# EAGLE design breakout (EAGLE 9.4.2)
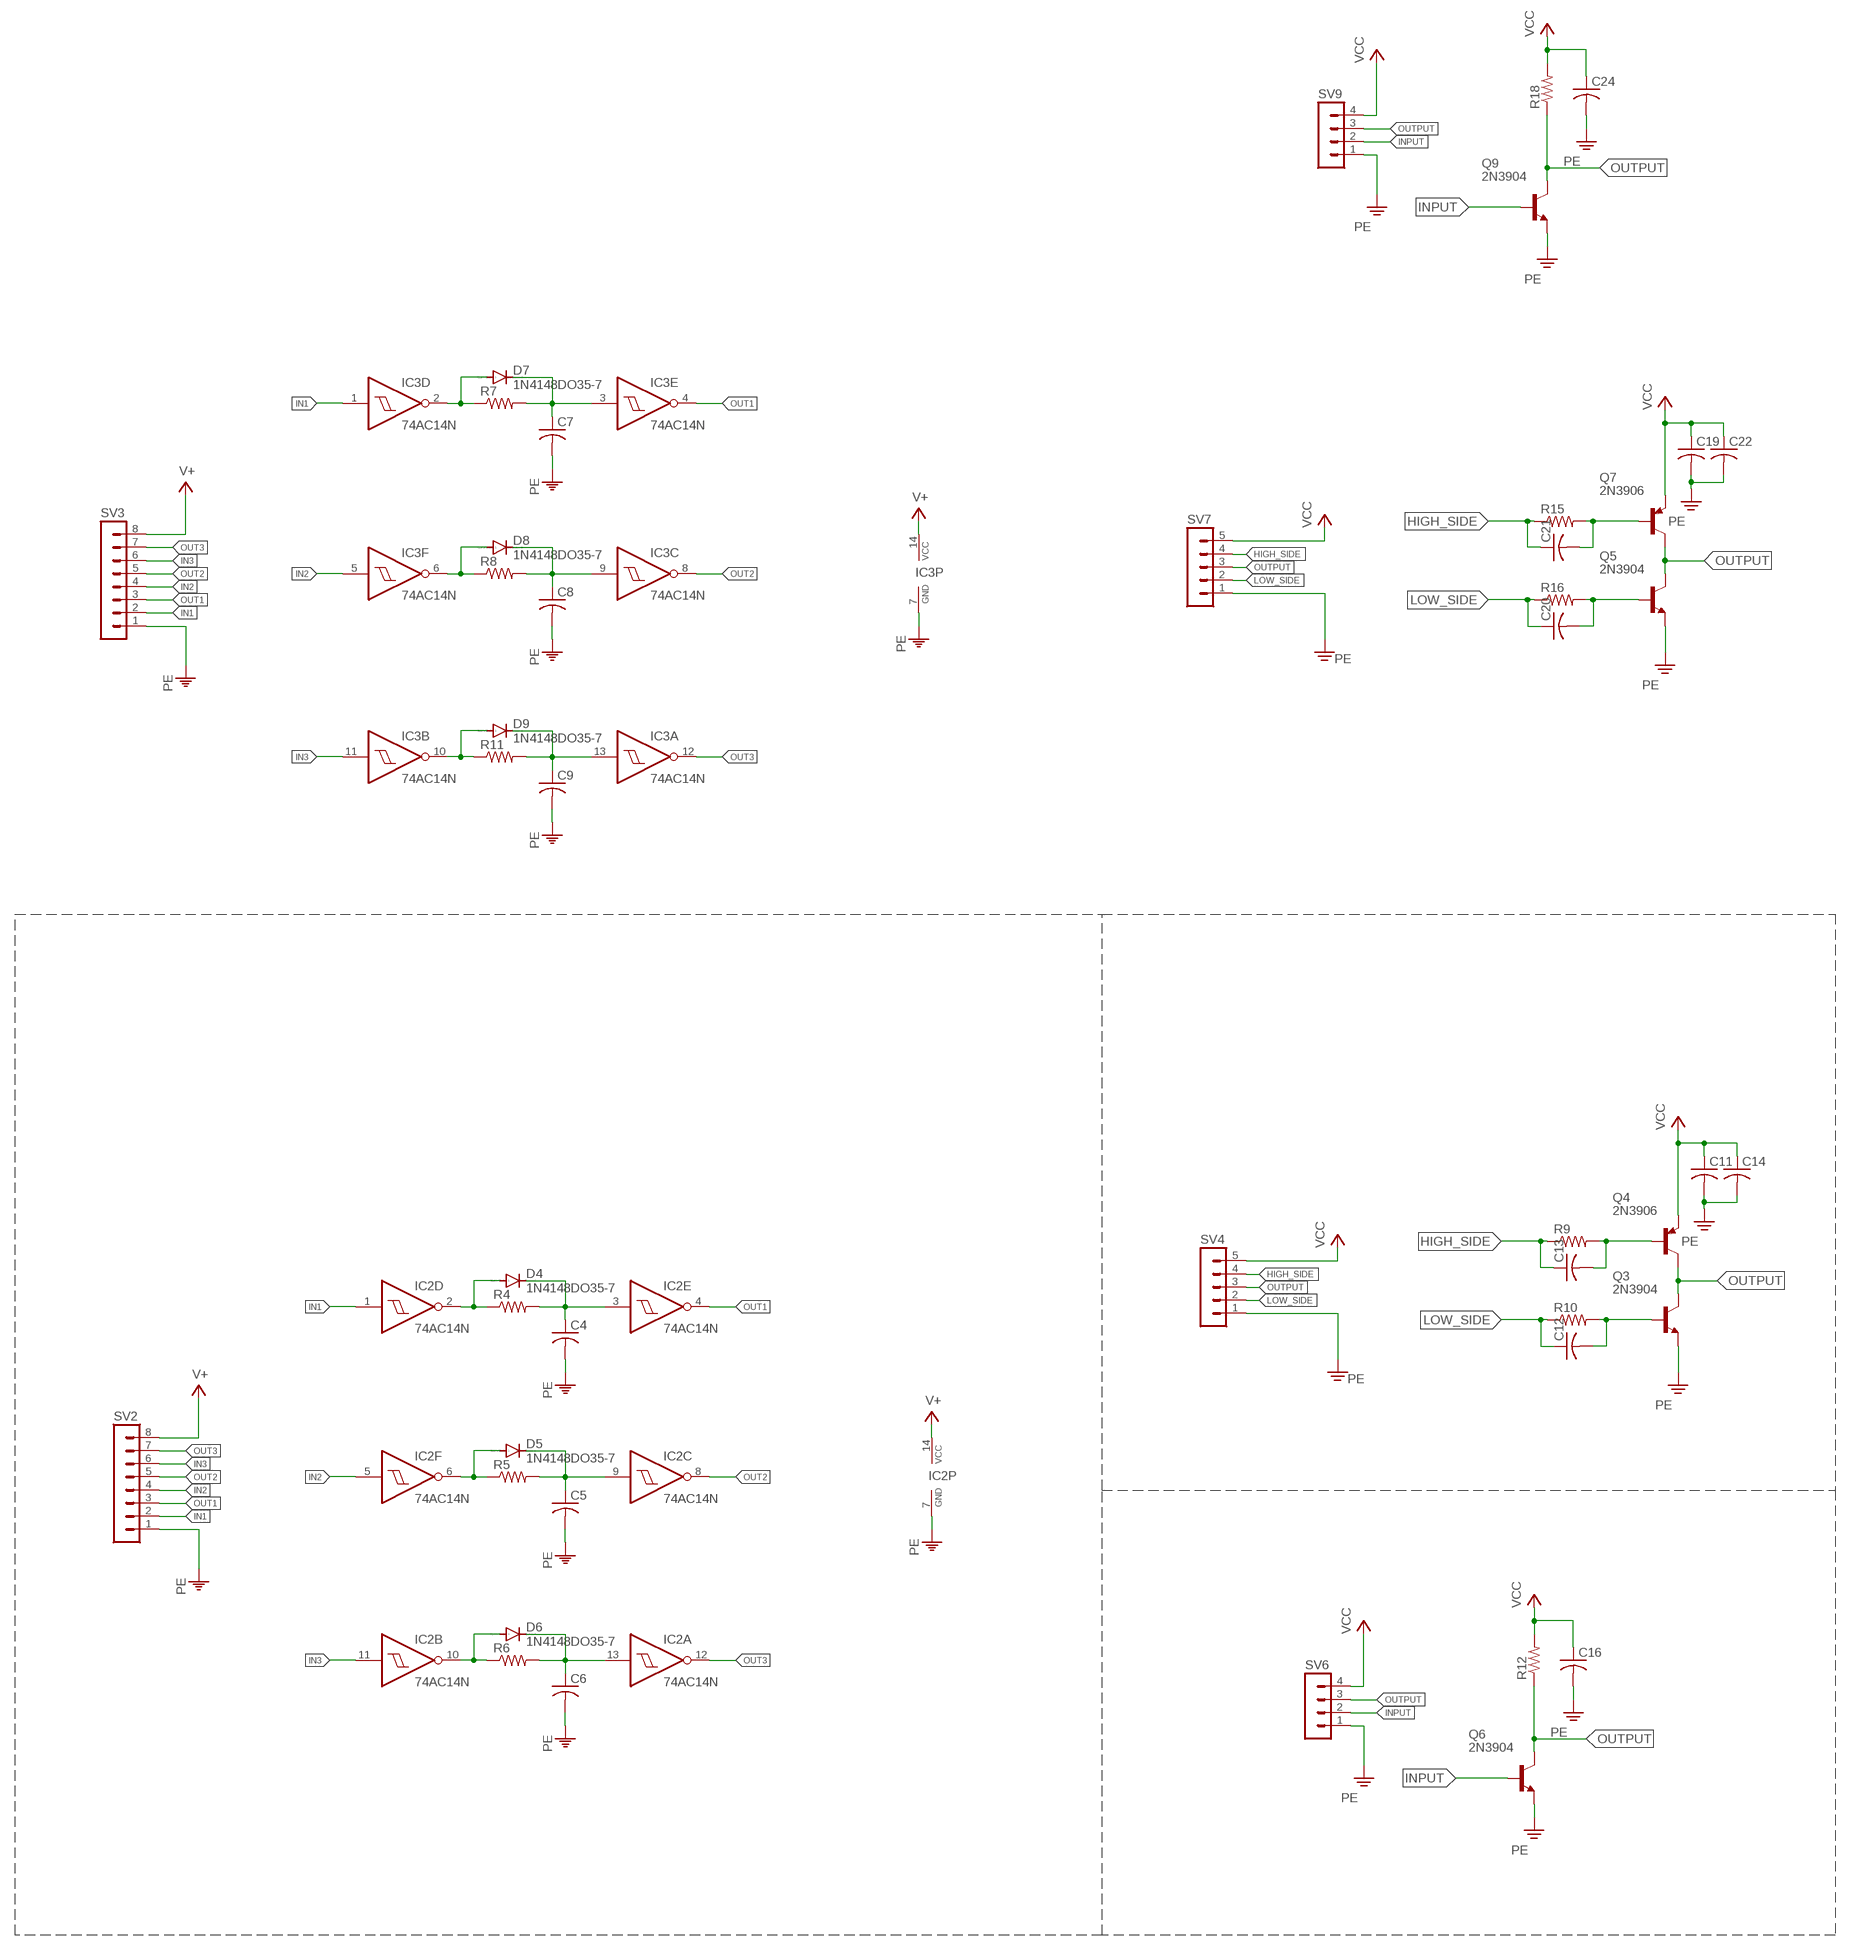
[diagram p0: schematic, sheet 1]

## Parts
C4  C-US025-025X050  [C025-025X050]
C5  C-US025-025X050  [C025-025X050]
C6  C-US025-025X050  [C025-025X050]
C7  C-US025-025X050  [C025-025X050]
C8  C-US025-025X050  [C025-025X050]
C9  C-US025-025X050  [C025-025X050]
C11  C-US050-024X044  [C050-024X044]
C12  C-US050-024X044  [C050-024X044]
C13  C-US050-024X044  [C050-024X044]
C14  C-US050-024X044  [C050-024X044]
C16  C-US025-030X050  [C025-030X050]
C19  C-US050-024X044  [C050-024X044]
C20  C-US050-024X044  [C050-024X044]
C21  C-US050-024X044  [C050-024X044]
C22  C-US050-024X044  [C050-024X044]
C24  C-US025-030X050  [C025-030X050]
D4  1N4148DO35-7  [DO35-7]
D5  1N4148DO35-7  [DO35-7]
D6  1N4148DO35-7  [DO35-7]
D7  1N4148DO35-7  [DO35-7]
D8  1N4148DO35-7  [DO35-7]
D9  1N4148DO35-7  [DO35-7]
IC2  74AC14N  [DIL14]
IC3  74AC14N  [DIL14]
Q3  2N3904  [TO-92]
Q4  2N3906  [TO-92]
Q5  2N3904  [TO-92]
Q6  2N3904  [TO-92]
Q7  2N3906  [TO-92]
Q9  2N3904  [TO-92]
R4  R-US_0204/7  [0204/7]
R5  R-US_0204/7  [0204/7]
R6  R-US_0204/7  [0204/7]
R7  R-US_0204/7  [0204/7]
R8  R-US_0204/7  [0204/7]
R9  R-US_0204/5  [0204/5]
R10  R-US_0204/5  [0204/5]
R11  R-US_0204/7  [0204/7]
R12  R-US_0204/7  [0204/7]
R15  R-US_0204/5  [0204/5]
R16  R-US_0204/5  [0204/5]
R18  R-US_0204/7  [0204/7]
SV2  MA08-1  [MA08-1]
SV3  MA08-1  [MA08-1]
SV4  MA05-1  [MA05-1]
SV6  MA04-1  [MA04-1]
SV7  MA05-1  [MA05-1]
SV9  MA04-1  [MA04-1]

## Nets
HIGH_SIDE: C13.1 C21.1 R9.1 R15.1 SV4.4 SV7.4
IN1: IC2.1(D:I) IC3.1(D:I) SV2.2 SV3.2
IN2: IC2.5(F:I) IC3.5(F:I) SV2.4 SV3.4
IN3: IC2.11(B:I) IC3.11(B:I) SV2.6 SV3.6
INPUT: Q6.B Q9.B SV6.2 SV9.2
LOW_SIDE: C12.1 C20.1 R10.1 R16.1 SV4.2 SV7.2
N$4: C4.1 D4.C IC2.3(E:I) R4.2
N$5: D4.A IC2.2(D:O) R4.1
N$9: C5.1 D5.C IC2.9(C:I) R5.2
N$10: D5.A IC2.6(F:O) R5.1
N$11: C6.1 D6.C IC2.13(A:I) R6.2
N$12: D6.A IC2.10(B:O) R6.1
N$13: C7.1 D7.C IC3.3(E:I) R7.2
N$14: D7.A IC3.2(D:O) R7.1
N$15: C13.2 Q4.B R9.2
N$16: C12.2 Q3.B R10.2
N$17: C8.1 D8.C IC3.9(C:I) R8.2
N$18: D8.A IC3.6(F:O) R8.1
N$19: C9.1 D9.C IC3.13(A:I) R11.2
N$20: D9.A IC3.10(B:O) R11.1
N$23: C21.2 Q7.B R15.2
N$24: C20.2 Q5.B R16.2
OUT1: IC2.4(E:O) IC3.4(E:O) SV2.3 SV3.3
OUT2: IC2.8(C:O) IC3.8(C:O) SV2.5 SV3.5
OUT3: IC2.12(A:O) IC3.12(A:O) SV2.7 SV3.7
OUTPUT: Q3.C Q4.C Q5.C Q6.C Q7.C Q9.C R12.1 R18.1 SV4.3 SV6.3 SV7.3 SV9.3
PE: C4.2 C5.2 C6.2 C7.2 C8.2 C9.2 C11.2 C14.2 C16.2 C19.2 C22.2 C24.2 IC2.7(P:GND) IC3.7(P:GND) Q3.E Q5.E Q6.E Q9.E SV2.1 SV3.1 SV4.1 SV6.1 SV7.1 SV9.1
V+: IC2.14(P:VCC) IC3.14(P:VCC) SV2.8 SV3.8
VCC: C11.1 C14.1 C16.1 C19.1 C22.1 C24.1 Q4.E Q7.E R12.2 R18.2 SV4.5 SV6.4 SV7.5 SV9.4

## Library data of the parts
C4-C9 C11-C14 C16 C19-C22 C24 = rcl:C-US: CAPACITOR, American symbol; SPICEPREFIX: C
D4-D9 = diode:1N4148: DIODE high speed (Philips)
IC2 IC3 = 74xx-eu:74*14: Hex schmitt trigger INVERTER
Q3 Q5 Q6 Q9 = transistors:2N3904
Q4 Q7 = transistors:2N3906
R4-R12 R15 R16 R18 = rcl:R-US_: RESISTOR, American symbol; SPICEPREFIX: R
SV2 SV3 = con-lstb:MA08-1: PIN HEADER; OC_FARNELL: unknown; OC_NEWARK: unknown
SV4 SV7 = con-lstb:MA05-1: PIN HEADER; OC_FARNELL: unknown; OC_NEWARK: unknown
SV6 SV9 = con-lstb:MA04-1: PIN HEADER; OC_FARNELL: unknown; OC_NEWARK: unknown

## Board
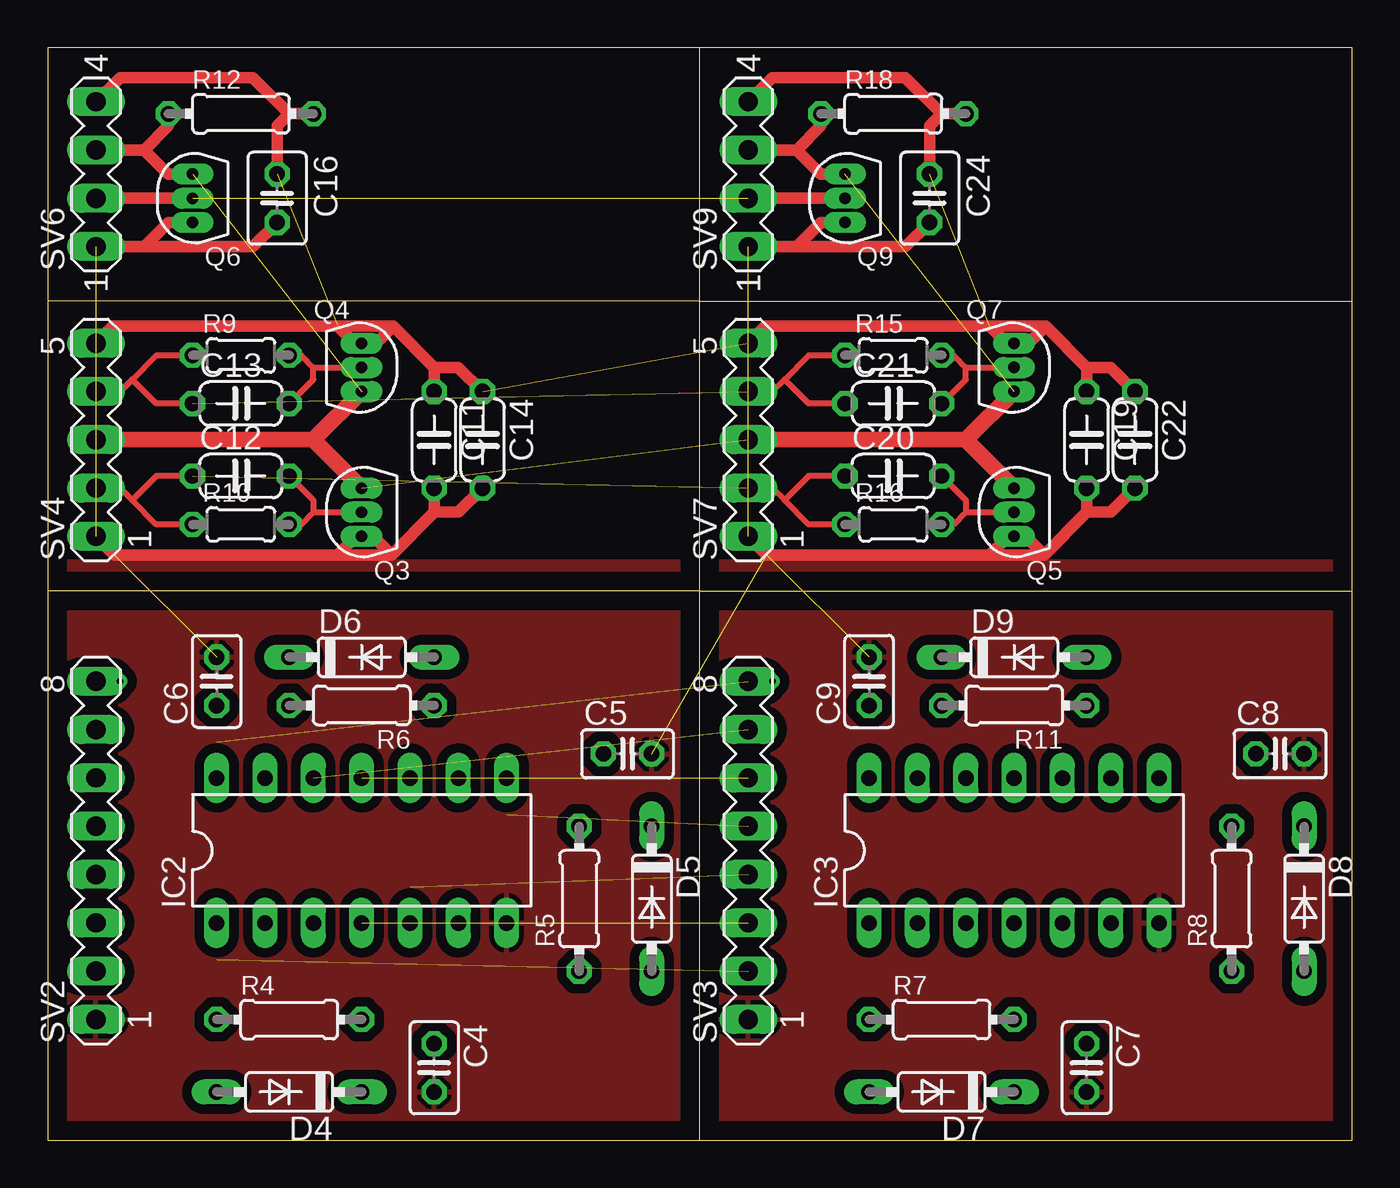
[diagram p1: board, top side]
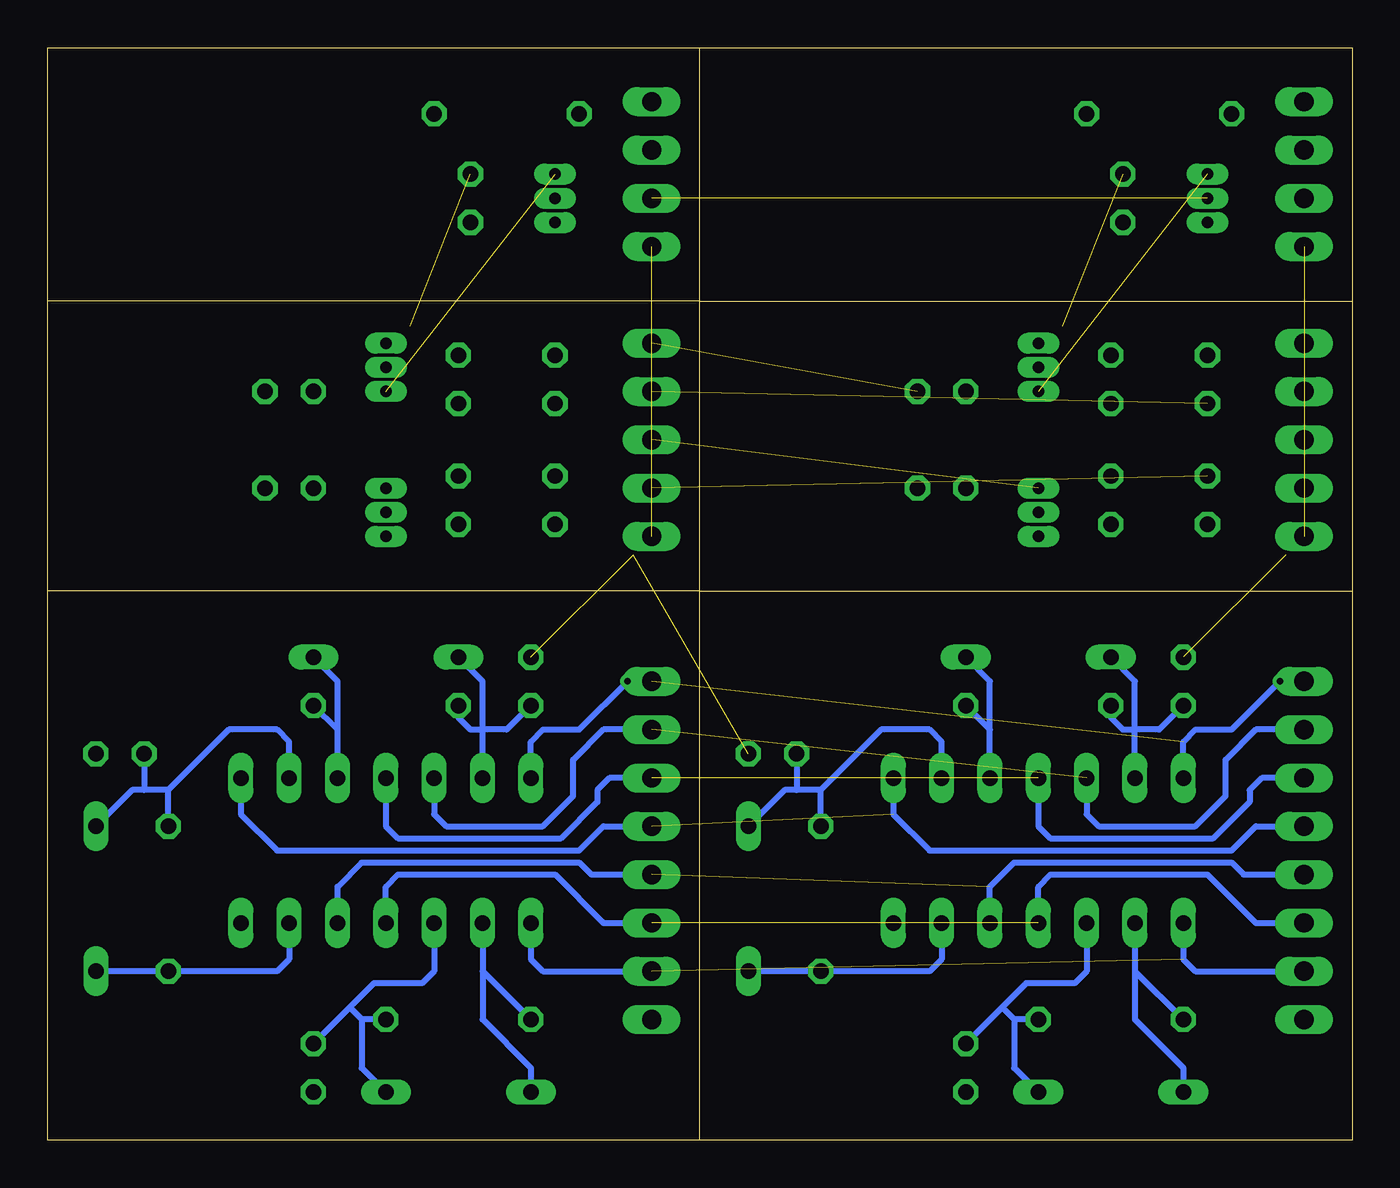
[diagram p2: board, bottom side, seen from below]

Size 68.58 x 57.45 mm. Coordinates in mm from the lower left corner, seen from the top.
Outline: 34.29,28.88 34.29,44.12
Outline: 34.29,44.12 0,44.12
Outline: 0,44.12 0,28.88
Outline: 34.29,44.12 34.29,57.45
Outline: 34.29,57.45 0,57.45 0,44.12
Outline: 34.29,0 0,0 0,28.88
Outline: 34.29,0 34.29,28.88
Outline: 34.29,28.88 0,28.88
Outline: 34.29,57.45 68.58,57.45 68.58,44.12
Outline: 34.29,0 68.58,0 68.58,28.88
Outline: 68.58,28.88 68.58,44.12
Outline: 34.29,28.88 68.58,28.88
Outline: 34.29,44.12 68.58,44.12
Copper layers (1*16): Top 0.035mm / dielectric 1.5mm / Bottom 0.035mm
Design rules "default": minimum track width 6mil, minimum drill 0.35mm, track to track 6mil, track to pad 6mil, pad to pad 6mil, via to via 6mil, smd to smd 6mil, copper to edge 40mil, drill to drill 6mil, minimum pad ring 10mil, minimum via ring 8mil, stop-mask expansion 4mil, vias tented up to drill 0mil, thermal gap 10mil

### Footprints (pad centres in the part's own frame; a part is rotated, then mirrored left to right if it is on the bottom)
C025-025X050 = drill 0.813 octagon: 1 -1.27,0; 2 1.27,0
C050-024X044 = drill 0.813 octagon: 1 -2.54,0; 2 2.54,0
C025-030X050 = drill 0.813 octagon: 1 -1.27,0; 2 1.27,0
DO35-7 = drill 0.813 long: A 3.81,0; C -3.81,0
DIL14 = drill 0.813 long: 1 -7.62,-3.81; 2 -5.08,-3.81; 3 -2.54,-3.81; 4 0,-3.81; 5 2.54,-3.81; 6 5.08,-3.81; 7 7.62,-3.81; 8 7.62,3.81; 9 5.08,3.81; 10 2.54,3.81; 11 0,3.81; 12 -2.54,3.81; 13 -5.08,3.81; 14 -7.62,3.81
TO-92 = drill 0.6 pad 0.762 long: B 0,0; C 0,-1.27; E 0,1.27
0204/7 = drill 0.813 octagon: 1 -3.81,0; 2 3.81,0
0204/5 = drill 0.813 octagon: 1 -2.54,0; 2 2.54,0
MA08-1 = drill 1.016 long: 1 -8.89,0; 2 -6.35,0; 3 -3.81,0; 4 -1.27,0; 5 1.27,0; 6 3.81,0; 7 6.35,0; 8 8.89,0
MA05-1 = drill 1.016 long: 1 -5.08,0; 2 -2.54,0; 3 0,0; 4 2.54,0; 5 5.08,0
MA04-1 = drill 1.016 long: 1 -3.81,0; 2 -1.27,0; 3 1.27,0; 4 3.81,0

### Placement (x,y rotation side)
C4  20.32,3.81 270 top
C5  30.48,20.32 0 top
C6  8.89,24.13 90 top
C7  54.61,3.81 270 top
C8  64.77,20.32 0 top
C9  43.18,24.13 90 top
C11  20.32,36.83 270 top
C12  10.16,34.92 0 top
C13  10.16,38.73 0 top
C14  22.86,36.83 270 top
C16  12.06,49.53 270 top
C19  54.61,36.83 270 top
C20  44.45,34.92 0 top
C21  44.45,38.73 0 top
C22  57.15,36.83 270 top
C24  46.35,49.53 270 top
D4  12.7,2.54 180 top
D5  31.75,12.7 270 top
D6  16.51,25.4 0 top
D7  46.99,2.54 180 top
D8  66.04,12.7 270 top
D9  50.8,25.4 0 top
IC2  16.51,15.24 0 top
IC3  50.8,15.24 0 top
Q3  16.51,33.02 180 top
Q4  16.51,40.64 0 top
Q5  50.8,33.02 180 top
Q6  7.62,49.53 180 top
Q7  50.8,40.64 0 top
Q9  41.91,49.53 180 top
R4  12.7,6.35 0 top
R5  27.94,12.7 90 top
R6  16.51,22.86 180 top
R7  46.99,6.35 0 top
R8  62.23,12.7 90 top
R9  10.16,41.27 0 top
R10  10.16,32.38 0 top
R11  50.8,22.86 180 top
R12  10.16,53.98 0 top
R15  44.45,41.27 0 top
R16  44.45,32.38 0 top
R18  44.45,53.98 0 top
SV2  2.54,15.24 90 top
SV3  36.83,15.24 90 top
SV4  2.54,36.83 90 top
SV6  2.54,50.8 90 top
SV7  36.83,36.83 90 top
SV9  36.83,50.8 90 top

### Tracks (layer width: path | path; a pad name or v marks a point on that pad's centre or on a via)
HIGH_SIDE  (1 unrouted)
  Top 0.305: R9.1 5.71,41.27 4.45,40.01 | SV4.4 3.81,39.37 4.45,40.01 | C13.1 5.71,38.73 4.45,40.01 | R15.1 40.01,41.27 38.73,40.01 | SV7.4 38.1,39.37 38.73,40.01 | C21.1 40.01,38.73 38.73,40.01
IN1  (1 unrouted)
  Bottom 0.305: IC2.1 8.89,9.53 8.26,8.89 SV2.2 | IC3.1 43.18,9.53 42.55,8.89 SV3.2
IN2  (1 unrouted)
  Bottom 0.305: SV2.4 5.71,13.97 6.35,14.61 17.78,14.61 19.05,13.34 IC2.5 | SV3.4 40.01,13.97 40.64,14.61 52.07,14.61 53.34,13.34 IC3.5
IN3  (1 unrouted)
  Bottom 0.305: IC2.11 16.51,16.51 15.88,15.88 7.3,15.88 5.4,17.78 5.4,18.41 4.76,19.05 SV2.6 | IC3.11 50.8,16.51 50.16,15.88 41.59,15.88 39.69,17.78 39.69,18.41 39.05,19.05 SV3.6
INPUT  (1 unrouted)
  Top 0.61: SV6.2 Q6.B | SV9.2 Q9.B
LOW_SIDE  (1 unrouted)
  Top 0.305: SV4.2 3.81,34.29 4.45,33.66 | 4.45,33.66 5.71,32.38 R10.1 | C12.1 5.71,34.92 4.45,33.66 | SV7.2 38.1,34.29 38.73,33.66 | 38.73,33.66 40.01,32.38 R16.1 | C20.1 40.01,34.92 38.73,33.66
N$4
  Bottom 0.305: 18.41,6.99 17.14,8.26 14.61,8.26 13.97,8.89 IC2.3 | 18.41,6.99 C4.1 | R4.2 17.78,6.35 | 17.78,6.35 18.41,6.99 | 17.78,6.35 17.78,3.81 D4.C
N$5
  Bottom 0.305: D4.A 8.89,3.81 11.43,6.35 11.43,8.89 | IC2.2 11.43,8.89 | 11.43,8.89 R4.1
N$9
  Bottom 0.305: C5.1 29.21,18.41 | D5.C 29.84,18.41 29.21,18.41 | IC2.9 21.59,20.95 22.23,21.59 24.77,21.59 27.94,18.41 | 27.94,18.41 29.21,18.41 | R5.2 27.94,18.41
N$10
  Bottom 0.305: D5.A R5.1 22.23,8.89 21.59,9.53 IC2.6
N$11
  Bottom 0.305: IC2.13 11.43,21.59 | 11.43,21.59 11.43,24.13 D6.C | R6.2 12.7,22.23 12.06,21.59 11.43,21.59 | C6.1 10.16,21.59 11.43,21.59
N$12
  Bottom 0.305: IC2.10 19.05,21.59 | 19.05,21.59 R6.1 | 19.05,21.59 19.05,24.13 D6.A
N$13
  Bottom 0.305: 52.7,6.99 51.44,8.26 48.9,8.26 48.26,8.89 IC3.3 | 52.7,6.99 C7.1 | R7.2 52.07,6.35 | 52.07,6.35 52.7,6.99 | 52.07,6.35 52.07,3.81 D7.C
N$14
  Bottom 0.305: D7.A 43.18,3.81 45.72,6.35 45.72,8.89 | IC3.2 45.72,8.89 | 45.72,8.89 R7.1
N$15
  Top 0.305: 13.97,40.64 Q4.B | C13.2 13.97,40.01 13.97,40.64 | R9.2 13.34,41.27 13.97,40.64
N$16
  Top 0.305: 13.97,33.02 Q3.B | C12.2 13.97,33.66 13.97,33.02 | R10.2 13.34,32.38 13.97,33.02
N$17
  Bottom 0.305: C8.1 63.5,18.41 | D8.C 64.14,18.41 63.5,18.41 | IC3.9 55.88,20.95 56.52,21.59 59.05,21.59 62.23,18.41 | 62.23,18.41 63.5,18.41 | R8.2 62.23,18.41
N$18
  Bottom 0.305: D8.A R8.1 56.52,8.89 55.88,9.53 IC3.6
N$19
  Bottom 0.305: IC3.13 45.72,21.59 | 45.72,21.59 45.72,24.13 D9.C | R11.2 46.99,22.23 46.35,21.59 45.72,21.59 | C9.1 44.45,21.59 45.72,21.59
N$20
  Bottom 0.305: IC3.10 53.34,21.59 | 53.34,21.59 R11.1 | 53.34,21.59 53.34,24.13 D9.A
N$23
  Top 0.305: 48.26,40.64 Q7.B | C21.2 48.26,40.01 48.26,40.64 | R15.2 47.62,41.27 48.26,40.64
N$24
  Top 0.305: 48.26,33.02 Q5.B | C20.2 48.26,33.66 48.26,33.02 | R16.2 47.62,32.38 48.26,33.02
OUT1  (1 unrouted)
  Bottom 0.305: IC2.4 16.51,13.34 15.88,13.97 7.62,13.97 5.08,11.43 SV2.3 | IC3.4 50.8,13.34 50.16,13.97 41.91,13.97 39.37,11.43 SV3.3
OUT2  (1 unrouted)
  Bottom 0.305: SV2.5 5.08,16.51 6.35,15.24 22.23,15.24 24.13,17.14 IC2.8 | SV3.5 39.37,16.51 40.64,15.24 56.52,15.24 58.42,17.14 IC3.8
OUT3  (1 unrouted)
  Bottom 0.305: SV2.7 5.08,21.59 6.67,20 6.67,18.1 8.26,16.51 13.34,16.51 13.97,17.14 IC2.12 | SV3.7 39.37,21.59 40.96,20 40.96,18.1 42.55,16.51 47.62,16.51 48.26,17.14 IC3.12
OUTPUT  (3 unrouted)
  Top 0.61: 5.08,52.07 SV6.3 3.17,52.07 | Q6.C 6.35,50.8 5.08,52.07 | R12.1 6.35,53.34 5.08,52.07 | 39.37,52.07 SV9.3 37.47,52.07 | Q9.C 40.64,50.8 39.37,52.07 | R18.1 40.64,53.34 39.37,52.07
  Top 0.813: SV4.3 13.97,36.83 | Q4.C 13.97,36.83 | Q3.C 13.97,36.83 | SV7.3 48.26,36.83 | Q7.C 48.26,36.83 | Q5.C 48.26,36.83
PE  (5 unrouted)
  Top 0.61: C11.2 20.32,33.02 | SV4.1 3.5,30.79 15.24,30.79 | Q3.E 16.61,31.75 | 20.32,33.02 18.09,30.79 | 18.09,30.79 15.24,30.79 | Q3.E 17.12,31.75 18.09,30.79 | Q3.E 16.2,31.75 15.24,30.79 | C14.2 21.59,33.02 20.32,33.02 | SV6.1 5.08,46.99 | Q6.E 6.35,48.26 5.08,46.99 | 5.08,46.99 10.79,46.99 C16.2 | C19.2 54.61,33.02 | SV7.1 37.8,30.79 49.53,30.79 | Q5.E 50.9,31.75 | 54.61,33.02 52.38,30.79 | 52.38,30.79 49.53,30.79 | Q5.E 51.41,31.75 52.38,30.79 | Q5.E 50.49,31.75 49.53,30.79 | C22.2 55.88,33.02 54.61,33.02 | SV9.1 39.37,46.99 | Q9.E 40.64,48.26 39.37,46.99 | 39.37,46.99 45.09,46.99 C24.2
  pour Top (isolate 0.508): -2.54,30.48 35.05,30.48 35.05,-2.54 -2.54,-2.54
  pour Top (isolate 0.508): 33.78,30.48 72.39,30.48 72.39,-2.54 33.78,-2.54
V+  (via drill 0.35)  (1 unrouted)
  Top 0.152: SV2.8 v3.81,24.13 | SV3.8 v38.1,24.13
  Bottom 0.305: v3.81,24.13 6.35,21.59 8.26,21.59 8.89,20.95 IC2.14 | v38.1,24.13 40.64,21.59 42.55,21.59 43.18,20.95 IC3.14
VCC  (3 unrouted)
  Top 0.152: C16.1 11.75,51.12 | C24.1 46.04,51.12
  Top 0.61: 18.16,42.8 20.32,40.64 | 20.32,40.64 C11.1 | SV4.5 3.43,42.8 15.24,42.8 | 15.24,42.8 18.16,42.8 | 15.24,42.8 16.13,41.91 Q4.E 17.27,41.91 18.16,42.8 | C14.1 21.59,40.64 20.32,40.64 | SV6.4 3.81,55.88 10.79,55.88 12.7,53.98 | R12.2 12.7,53.98 | 12.7,53.98 12.06,53.34 C16.1 | 52.45,42.8 54.61,40.64 | 54.61,40.64 C19.1 | SV7.5 37.72,42.8 49.53,42.8 | 49.53,42.8 52.45,42.8 | 49.53,42.8 50.42,41.91 Q7.E 51.56,41.91 52.45,42.8 | C22.1 55.88,40.64 54.61,40.64 | SV9.4 38.1,55.88 45.09,55.88 46.99,53.98 | R18.2 46.99,53.98 | 46.99,53.98 46.35,53.34 C24.1